# EAGLE schematic gpu (EAGLE 9.6.2)
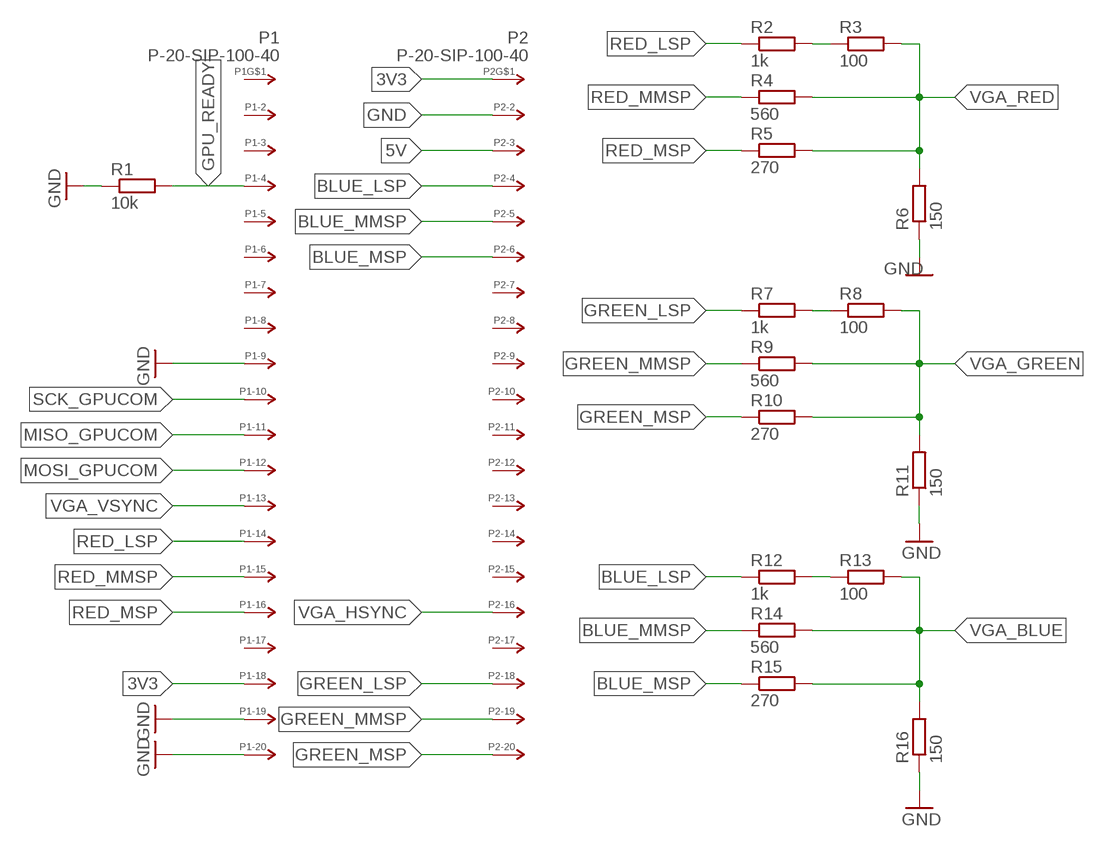
[diagram p0: schematic, sheet 1]

## Parts
P1  P-20-SIP-100-40  [SIP-100-20-40]
P2  P-20-SIP-100-40  [SIP-100-20-40]
R1  10k  R-EU_R0805  [R0805]
R2  1k  R-EU_R0805  [R0805]
R3  100  R-EU_R0805  [R0805]
R4  560  R-EU_R0805  [R0805]
R5  270  R-EU_R0805  [R0805]
R6  150  R-EU_R0805  [R0805]
R7  1k  R-EU_R0805  [R0805]
R8  100  R-EU_R0805  [R0805]
R9  560  R-EU_R0805  [R0805]
R10  270  R-EU_R0805  [R0805]
R11  150  R-EU_R0805  [R0805]
R12  1k  R-EU_R0805  [R0805]
R13  100  R-EU_R0805  [R0805]
R14  560  R-EU_R0805  [R0805]
R15  270  R-EU_R0805  [R0805]
R16  150  R-EU_R0805  [R0805]

## Nets
3V3: P1.18 P2.1
5V: P2.3
BLUE_LSP: P2.4 R12.1
BLUE_MMSP: P2.5 R14.1
BLUE_MSP: P2.6 R15.1
GND: P1.9 P1.19 P1.20 P2.2 R1.1 R6.1 R11.1 R16.1
GPU_READY: P1.4 R1.2
GREEN_LSP: P2.18 R7.1
GREEN_MMSP: P2.19 R9.1
GREEN_MSP: P2.20 R10.1
MISO_GPUCOM: P1.11
MOSI_GPUCOM: P1.12
N$4: R2.2 R3.1
N$5: R7.2 R8.1
N$9: R12.2 R13.1
RED_LSP: P1.14 R2.1
RED_MMSP: P1.15 R4.1
RED_MSP: P1.16 R5.1
SCK_GPUCOM: P1.10
VGA_BLUE: R13.2 R14.2 R15.2 R16.2
VGA_GREEN: R8.2 R9.2 R10.2 R11.2
VGA_HSYNC: P2.16
VGA_RED: R3.2 R4.2 R5.2 R6.2
VGA_VSYNC: P1.13
Unconnected: P1.1 P1.2 P1.3 P1.5 P1.6 P1.7 P1.8 P1.17 P2.7 P2.8 P2.9 P2.10 P2.11 P2.12 P2.13 P2.14 P2.15 P2.17

## Library data of the parts
P1 P2 = con-headers-jp:P-20-: HEADER PLUG PINS
R1-R16 = rcl:R-EU_: RESISTOR, European symbol; SPICEPREFIX: R